# EAGLE design chalupa (EAGLE 7.7.0)
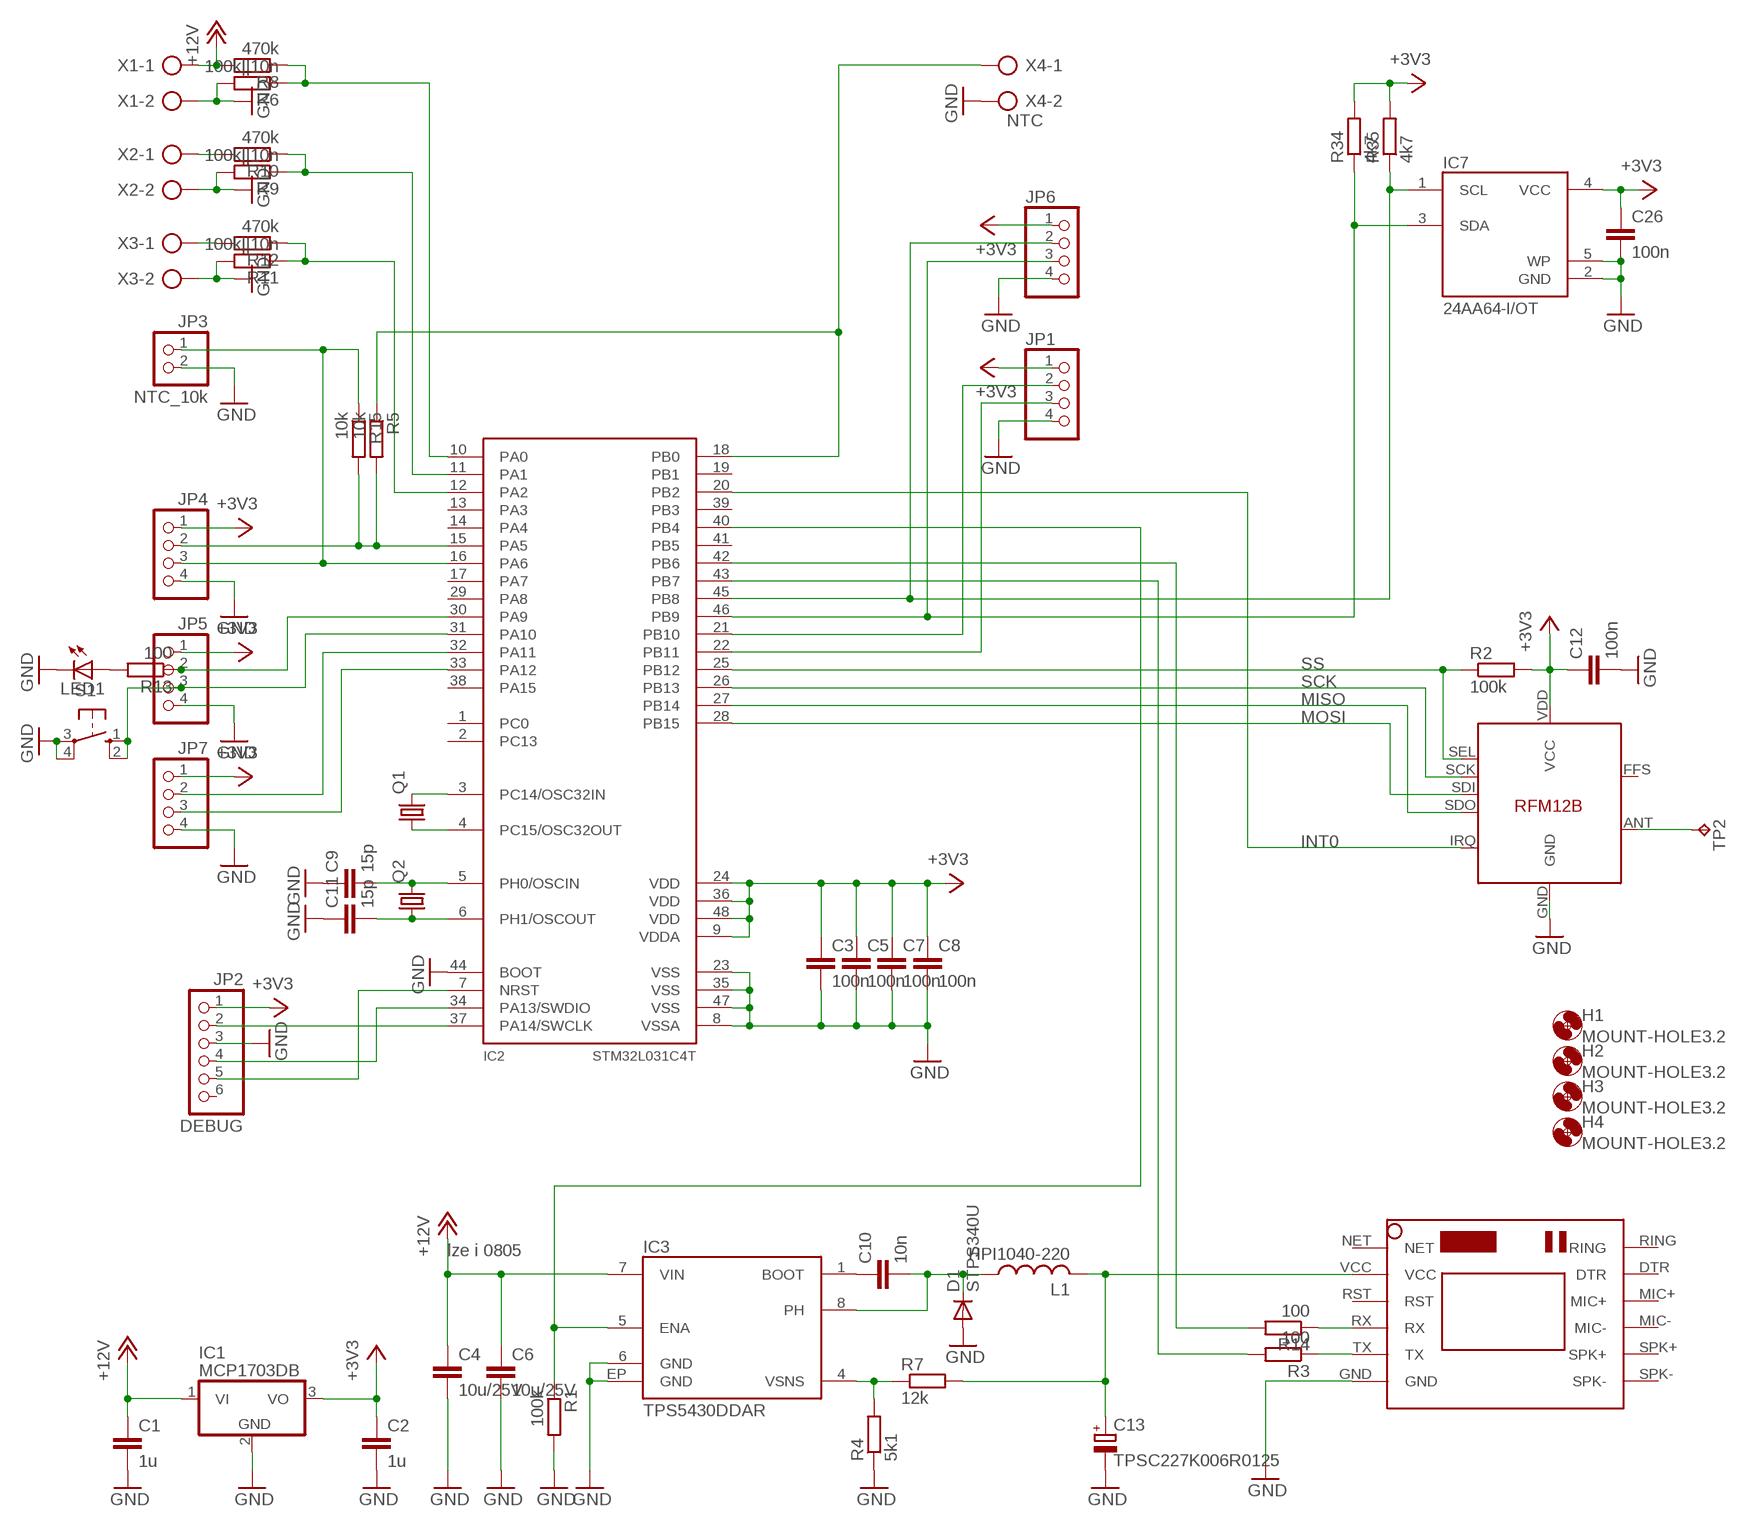
[diagram p0: schematic, sheet 1]

## Parts
C1  1u  C-EUC0603  [C0603]
C2  1u  C-EUC0603  [C0603]
C3  100n  C-EUC0603  [C0603]
C4  10u/25V  C-EUC1206  [C1206]
C5  100n  C-EUC0603  [C0603]
C6  10u/25V  C-EUC1206  [C1206]
C7  100n  C-EUC0603  [C0603]
C8  100n  C-EUC0603  [C0603]
C9  15p  C-EUC0603  [C0603]
C10  10n  C-EUC0603  [C0603]
C11  15p  C-EUC0603  [C0603]
C12  100n  C-EUC0603  [C0603]
C13  TPSC227K006R0125  CPOL-EUSMCC  [SMC_C]
C26  100n  C-EUC0603  [C0603]
D1  STPS340U  DIODE-SMB  [SMB]
H1  MOUNT-HOLE3.2  [3,2]
H2  MOUNT-HOLE3.2  [3,2]
H3  MOUNT-HOLE3.2  [3,2]
H4  MOUNT-HOLE3.2  [3,2]
IC1  MCP1703DB  [SOT223]
IC2  STM32L031C4T  [LQFP48]
IC3  TPS5430DDAR  TPS5430DDA  [DDA]
IC5  SIM800LMODULE  [SIM800LMODULE]
IC7  24AA64-I/OT  [SOT23-5]
JP1  PINHD-1X4  [1X04]
JP2  DEBUG  PINHD-1X6  [1X06]
JP3  NTC_10k  PINHD-1X2  [1X02]
JP4  PINHD-1X4  [1X04]
JP5  PINHD-1X4  [1X04]
JP6  PINHD-1X4  [1X04]
JP7  PINHD-1X4  [1X04]
L1  HPI1040-220  L-USHPI1040  [HPI1040]
LED1  LEDCHIP-LED0805  [CHIP-LED0805]
Q1  CRYSTALTC38H  [TC38H]
Q2  CRYSTALHC49UP  [HC49UP]
R1  100k  R-EU_R0603  [R0603]
R2  100k  R-EU_R0603  [R0603]
R3  100  R-EU_R0603  [R0603]
R4  5k1  R-EU_R0603  [R0603]
R5  10k  R-EU_R0603  [R0603]
R6  100k||10n  R-EU_R0603  [R0603]
R7  12k  R-EU_R0603  [R0603]
R8  470k  R-EU_R0603  [R0603]
R9  100k||10n  R-EU_R0603  [R0603]
R10  470k  R-EU_R0603  [R0603]
R11  100k||10n  R-EU_R0603  [R0603]
R12  470k  R-EU_R0603  [R0603]
R13  100  R-EU_R0603  [R0603]
R14  100  R-EU_R0603  [R0603]
R15  10k  R-EU_R0603  [R0603]
R34  4k7  R-EU_R0603  [R0603]
R35  4k7  R-EU_R0603  [R0603]
RFM12B  RFM12B  [RFM12B]
S1  10-XX  [B3F-10XX]
TP2  TPB2,54  [B2,54]
X1  AK500/2  [AK500/2]
X2  AK500/2  [AK500/2]
X3  AK500/2  [AK500/2]
X4  NTC  AK500/2  [AK500/2]

## Nets
+3V3 [power]: C2.1 C3.1 C5.1 C7.1 C8.1 C12.1 C26.1 IC1.3(VO) IC2.9(VDDA) IC2.24(VDD) IC2.36(VDD) IC2.48(VDD) IC7.4(VCC) JP1.1 JP2.1 JP4.1 JP5.1 JP6.1 JP7.1 R2.2 R34.2 R35.2 RFM12B.VDD(VCC)
+12V: C1.1 C4.1 C6.1 IC1.1(VI) IC3.7(VIN) R8.2 X1.1
EEP_SCL: IC2.45(PB8) IC7.1(SCL) JP6.2 R35.1
EEP_SDA: IC2.46(PB9) IC7.3(SDA) JP6.3 R34.1
GND: C1.2 C2.2 C3.2 C4.2 C5.2 C6.2 C7.2 C8.2 C9.1 C11.1 C12.2 C13.- C26.2 D1.A IC1.2(GND) IC2.8(VSSA) IC2.23(VSS) IC2.35(VSS) IC2.44(BOOT) IC2.47(VSS) IC3.6(GND) IC3.EP(GND) IC5.GND IC7.2(GND) IC7.5(WP) JP1.4 JP2.3 JP3.2 JP4.4 JP5.4 JP6.4 JP7.4 LED1.C R1.2 R4.1 R6.2 R9.2 R11.2 RFM12B.GND S1.3(P) S1.4(P1) X1.2 X2.2 X3.2 X4.2
GSM_EN: IC2.40(PB4) IC3.5(ENA) R1.1
INT0: IC2.20(PB2) RFM12B.IRQ
MISO: IC2.27(PB14) RFM12B.SDO
MOSI: IC2.28(PB15) RFM12B.SDI
N$1: C11.2 IC2.6(PH1/OSCOUT) Q2.1
N$2: IC5.TX R3.1
N$3: C9.2 IC2.5(PH0/OSCIN) Q2.2
N$4: IC2.4(PC15/OSC32OUT) Q1.1
N$5: IC2.3(PC14/OSC32IN) Q1.2
N$6: RFM12B.ANT TP2.PP(TP)
N$7: IC2.42(PB6) R14.2
N$8: C10.1 IC3.1(BOOT)
N$9: C13.+ IC5.VCC L1.2 R7.2
N$10: C10.2 D1.C IC3.8(PH) L1.1
N$11: IC2.21(PB10) JP1.2
N$12: IC2.22(PB11) JP1.3
N$13: IC5.RX R14.1
N$14: LED1.A R13.2
N$15: IC2.31(PA10) JP5.3 S1.1(S) S1.2(S1)
N$16: IC2.18(PB0) R5.1 X4.1
N$17: R12.2 X3.1
N$18: R10.2 X2.1
N$20: IC2.10(PA0) R6.1 R8.1
N$21: IC2.11(PA1) R9.1 R10.1
N$22: IC2.12(PA2) R11.1 R12.1
N$25: IC3.4(VSNS) R4.2 R7.1
N$27: IC2.15(PA5) JP4.2 R5.2 R15.2
N$28: IC2.16(PA6) JP3.1 JP4.3 R15.1
N$29: IC2.30(PA9) JP5.2 R13.1
N$31: IC2.32(PA11) JP7.2
N$32: IC2.33(PA12) JP7.3
N$137: IC2.34(PA13/SWDIO) JP2.4
N$138: IC2.37(PA14/SWCLK) JP2.2
N$143: IC2.7(NRST) JP2.5
SCK: IC2.26(PB13) RFM12B.SCK
SS: IC2.25(PB12) R2.1 RFM12B.SEL
TX1: IC2.43(PB7) R3.2
Unconnected: IC2.1(PC0) IC2.2(PC13) IC2.13(PA3) IC2.14(PA4) IC2.17(PA7) IC2.19(PB1) IC2.29(PA8) IC2.38(PA15) IC2.39(PB3) IC2.41(PB5) IC5.DTR IC5.MIC+ IC5.MIC- IC5.NET IC5.RING IC5.RST IC5.SPK+ IC5.SPK- JP2.6 RFM12B.FFS

## Notes on the sheet
- lze i 0805

## Library data of the parts
C1-C12 C26 = rcl:C-EU: CAPACITOR, European symbol
C13 = rcl:CPOL-EU: POLARIZED CAPACITOR, European symbol
D1 = diode:DIODE-: DIODE
H1-H4 = holes:MOUNT-HOLE: MOUNTING HOLE with drill center marker
IC1 = linear:MCP1703: 250 mA, 16V, Low Quiescent Current LDO Regulator Source: http://ww1.microchip.com/downloads/en/DeviceDoc/22049b.pdf
IC2 = alpov2:STM32L031C4T
IC3 = hvac:TPS5430
IC5 = SIM800LMODULE:SIM800LMODULE: SIM800L Module
IC7 = satcam:24AA64
JP1 JP4-JP7 = pinhead:PINHD-1X4: PIN HEADER
JP2 = pinhead:PINHD-1X6: PIN HEADER
JP3 = pinhead:PINHD-1X2: PIN HEADER
L1 = loraobd:L-US
LED1 = led:LED: LED OSRAM: - CHIPLED LG R971, LG N971, LY N971, LG Q971, LY Q971, LO R971, LY R971 LH N974, LH R974 LS Q976, LO Q976, LY Q976 LO Q996 - Hyper CHIPLED LW Q18S LB Q993, LB Q99A, LB R99A - SideLED LS A670, LO A670, LY A670, LG A670, LP A670 LB A673, LV A673, LT A673, LW A673 LH A674 LY A675 LS A676, LA A676, LO A676, LY A676, LW A676 LS A679, LY A679, LG A679 - Hyper Micro SIDELED® LS Y876, LA Y876, LO Y876, LY Y876 LT Y87S - SmartLED LW L88C, LW L88S LB L89C, LB L89S, LG L890 LS L89K, LO L89K, LY L89K LS L896, LA L896, LO L896, LY L896 - TOPLED LS T670, LO T670, LY T670, LG T670, LP T670 LSG T670, LSP T670, LSY T670, LOP T670, LYG T670 LG T671, LOG T671, LSG T671 LB T673, LV T673, LT T673, LW T673 LH T674 LS T676, LA T676, LO T676, LY T676, LB T676, LH T676, LSB T676, LW T676 LB T67C, LV T67C, LT T67C, LS T67K, LO T67K, LY T67K, LW E67C LS E67B, LA E67B, LO E67B, LY E67B, LB E67C, LV E67C, LT E67C LW T67C LS T679, LY T679, LG T679 LS T770, LO T770, LY T770, LG T770, LP T770 LB T773, LV T773, LT T773, LW T773 LH T774 LS E675, LA E675, LY E675, LS T675 LS T776, LA T776, LO T776, LY T776, LB T776 LHGB T686 LT T68C, LB T68C - Hyper Mini TOPLED® LB M676 - Mini TOPLED Santana® LG M470 LS M47K, LO M47K, LY M47K Source: http://www.osram.convergy.de LUXEON: - LUMILED® LXK2-PW12-R00, LXK2-PW12-S00, LXK2-PW14-U00, LXK2-PW14-V00 LXK2-PM12-R00, LXK2-PM12-S00, LXK2-PM14-U00 LXK2-PE12-Q00, LXK2-PE12-R00, LXK2-PE12-S00, LXK2-PE14-T00, LXK2-PE14-U00 LXK2-PB12-K00, LXK2-PB12-L00, LXK2-PB12-M00, LXK2-PB14-N00, LXK2-PB14-P00, LXK2-PB14-Q00 LXK2-PR12-L00, LXK2-PR12-M00, LXK2-PR14-Q00, LXK2-PR14-R00 LXK2-PD12-Q00, LXK2-PD12-R00, LXK2-PD12-S00 LXK2-PH12-R00, LXK2-PH12-S00 LXK2-PL12-P00, LXK2-PL12-Q00, LXK2-PL12-R00 Source: www.luxeon.com KINGBRIGHT: KA-3528ASYC Source: www.kingbright.com
Q1 Q2 = crystal:CRYSTAL: CRYSTAL; OC_FARNELL: unknown; OC_NEWARK: unknown
R1-R15 R34 R35 = rcl:R-EU_: RESISTOR, European symbol
RFM12B = JeeLabs:RFM12B
S1 = switch-omron:10-XX: OMRON SWITCH; MPN: B3F-1000; OC_FARNELL: 176432; OC_NEWARK: 36M3542
TP2 = testpad:TP: Test pad
X1-X4 = con-ptr500:AK500/2: CONNECTOR; OC_FARNELL: unknown; OC_NEWARK: unknown

## Net classes
1 power: width 0.2 mm

## Board
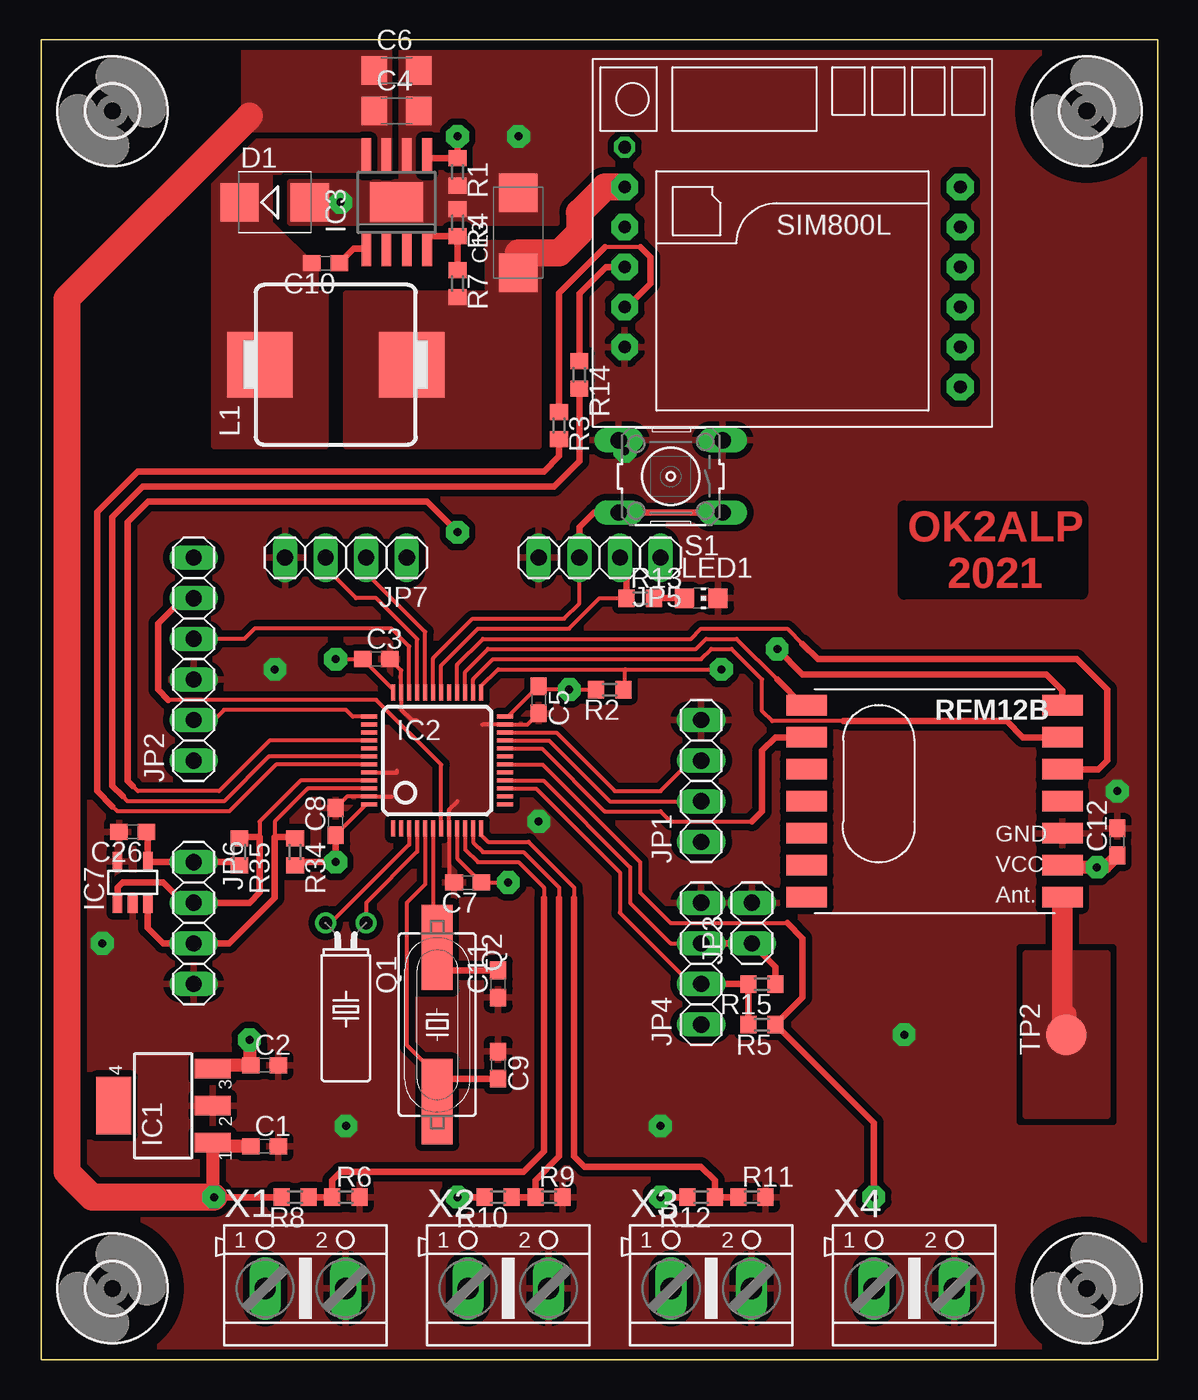
[diagram p1: board, top side]
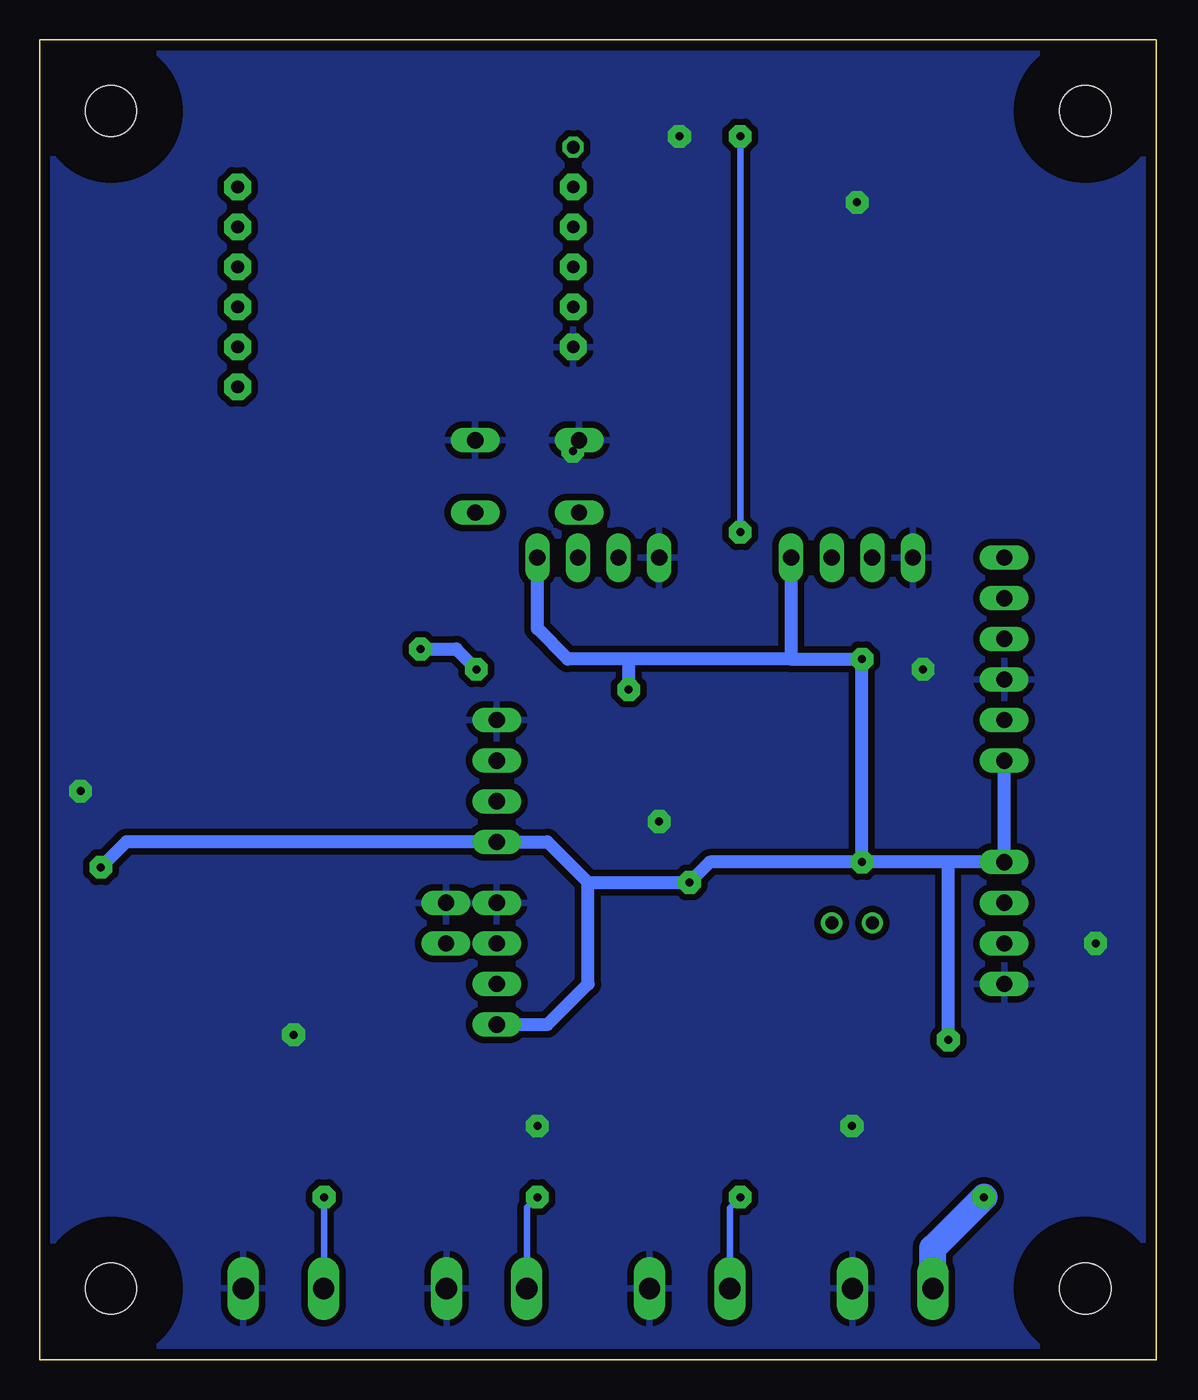
[diagram p2: board, bottom side, seen from below]

Size 69.85 x 82.55 mm. Coordinates in mm from the lower left corner, seen from the top.
Outline: 0,0 69.85,0 69.85,82.55 0,82.55 0,0
Copper layers (1*16): Top 0.035mm / dielectric 1.5mm / Bottom 0.035mm
Design rules "default *": minimum track width 0.25mm, minimum drill 0.5mm, track to track 8mil, track to pad 8mil, pad to pad 8mil, via to via 8mil, smd to smd 0mil, copper to edge 24mil, drill to drill 8mil, minimum pad ring 10mil, minimum via ring 8mil, stop-mask expansion 4mil, vias tented up to drill 0mil, thermal gap 16mil
tRestrict: 4 lines

### Footprints (pad centres in the part's own frame; a part is rotated, then mirrored left to right if it is on the bottom)
C0603 = smd 1.1 x 1: 1 -0.85,0; 2 0.85,0
C1206 = smd 1.6 x 1.8: 1 -1.4,0; 2 1.4,0
SMC_C = smd 2.4 x 2.4: + -2.5,0; - 2.5,0
SMB = smd 2.4 x 2.4: A 2.2,0; C -2.2,0
3,2 = hole 3.2: 0,0
SOT223 = smd 1.219 x 2.235: 1 -2.311,-3.099; 2 0,-3.099; 3 2.311,-3.099 | smd 3.6 x 2.2: 4 0,3.099
LQFP48 = smd 0.25 x 1: 1 -2.75,-4.25; 2 -2.25,-4.25; 3 -1.75,-4.25; 4 -1.25,-4.25; 5 -0.75,-4.25; 6 -0.25,-4.25; 7 0.25,-4.25; 8 0.75,-4.25; 9 1.25,-4.25; 10 1.75,-4.25; 11 2.25,-4.25; 12 2.75,-4.25; 25 2.75,4.25; 26 2.25,4.25; 27 1.75,4.25; 28 1.25,4.25; 29 0.75,4.25; 30 0.25,4.25; 31 -0.25,4.25; 32 -0.75,4.25; 33 -1.25,4.25; 34 -1.75,4.25; 35 -2.25,4.25; 36 -2.75,4.25 | smd 1 x 0.25: 13 4.25,-2.75; 14 4.25,-2.25; 15 4.25,-1.75; 16 4.25,-1.25; 17 4.25,-0.75; 18 4.25,-0.25; 19 4.25,0.25; 20 4.25,0.75; 21 4.25,1.25; 22 4.25,1.75; 23 4.25,2.25; 24 4.25,2.75; 37 -4.25,2.75; 38 -4.25,2.25; 39 -4.25,1.75; 40 -4.25,1.25; 41 -4.25,0.75; 42 -4.25,0.25; 43 -4.25,-0.25; 44 -4.25,-0.75; 45 -4.25,-1.25; 46 -4.25,-1.75; 47 -4.25,-2.25; 48 -4.25,-2.75
DDA = smd 0.6 x 2.2: 1 -1.905,-2.9; 2 -0.635,-2.9; 3 0.635,-2.9; 4 1.905,-2.9; 5 1.905,2.9; 6 0.635,2.9; 7 -0.635,2.9; 8 -1.905,2.9 | smd 3.3 x 2.5: EP 0,0
SIM800LMODULE = drill 0.8 pad 1.676 octagon: DTR 10.5,1; GND -10.5,-6.5; MIC+ 10.5,-1.5; MIC- 10.5,-4; RING 10.5,3.5; RST -10.5,1; RX -10.5,-1.5; SPK+ 10.5,-6.5; SPK- 10.5,-9; TX -10.5,-4; VCC -10.5,3.5 | drill 0.8 octagon: NET -10.5,6
SOT23-5 = smd 0.6 x 1.2: 1 -0.95,-1.306; 2 0,-1.306; 3 0.95,-1.306; 4 0.95,1.306; 5 -0.95,1.306
1X04 = drill 1.016 long: 1 -3.81,0; 2 -1.27,0; 3 1.27,0; 4 3.81,0
1X06 = drill 1.016 long: 1 -6.35,0; 2 -3.81,0; 3 -1.27,0; 4 1.27,0; 5 3.81,0; 6 6.35,0
1X02 = drill 1.016 long: 1 -1.27,0; 2 1.27,0
HPI1040 = smd 4.1 x 4.1: 1 0,4.75; 2 0,-4.75
CHIP-LED0805 = smd 1.2 x 1.2: A 0,-1.05; C 0,1.05
TC38H = drill 0.813: 1 -1.27,0; 2 1.27,0
HC49UP = smd 5.334 x 1.93: 1 -4.826,0; 2 4.826,0
R0603 = smd 1 x 1.1: 1 -0.85,0; 2 0.85,0
RFM12B = smd 2.54 x 1.27: ANT 8,-6; FFS -8,2; GND 8,-2; IRQ -8,4; P$8 -8,0; P$9 -8,-2; P$10 -8,-4; P$12 -8,-6; P$16 8,0; SCK 8,4; SDI 8,2; SDO -8,6; SEL 8,6; VDD 8,-4
B3F-10XX = drill 1.016 long: 1 -3.251,2.261; 2 3.251,2.261; 3 -3.251,-2.261; 4 3.251,-2.261
B2,54 = smd 2.54 x 2.54: PP 0,0
AK500/2 = drill 1.321 long: 1 -2.515,0; 2 2.515,0

### Placement (x,y rotation side)
C1  13.97,13.34 0 top
C2  13.97,18.41 0 top
C3  20.95,43.81 0 top
C4  22.23,78.11 0 top
C5  31.11,41.27 270 top
C6  22.23,80.64 0 top
C7  26.67,29.84 180 top
C8  18.41,33.66 90 top
C9  28.57,18.41 270 top
C10  17.78,68.58 180 top
C11  28.57,23.5 90 top
C12  67.31,32.38 90 top
C13  29.84,70.48 90 top
C26  5.71,33.02 180 top
D1  14.61,72.39 0 top
H1  4.45,4.45 0 top
H2  65.41,4.45 0 top
H3  4.45,78.11 0 top
H4  65.41,78.11 0 top
IC1  7.62,15.88 90 top
IC2  24.77,37.47 0 top
IC3  22.23,72.39 0 top
IC5  46.99,69.85 0 top
IC7  5.71,29.84 0 top
JP1  41.27,36.2 90 top
JP2  9.53,43.81 90 top
JP3  44.45,27.3 90 top
JP4  41.27,24.77 90 top
JP5  34.92,50.16 180 top
JP6  9.53,27.3 270 top
JP7  19.05,50.16 180 top
L1  18.41,62.23 90 top
LED1  41.27,47.62 270 top
Q1  19.05,27.3 180 top
Q2  24.77,20.95 270 top
R1  26.04,74.3 270 top
R2  35.56,41.91 180 top
R3  32.38,58.42 270 top
R4  26.04,71.12 270 top
R5  45.09,20.95 180 top
R6  19.05,10.16 0 top
R7  26.04,67.31 270 top
R8  15.88,10.16 180 top
R9  31.75,10.16 0 top
R10  28.57,10.16 180 top
R11  44.45,10.16 0 top
R12  41.27,10.16 180 top
R13  37.47,47.62 0 top
R14  33.66,61.59 270 top
R15  45.09,23.5 180 top
R34  15.88,31.75 270 top
R35  12.38,31.75 270 top
RFM12B  55.88,34.92 0 top
S1  39.37,55.24 180 top
TP2  64.14,20.32 90 top
X1  16.51,4.45 0 top
X2  29.21,4.45 0 top
X3  41.91,4.45 0 top
X4  54.61,4.45 0 top

### Tracks (layer width: path | path; a pad name or v marks a point on that pad's centre or on a via)
+3V3  (via drill 0.5 pad 1.42)
  Top 0.254: IC2.36 22.02,41.91 C3.1 v18.41,43.81 | IC2.24 29.2,40.22 C5.1 31.33,41.91 v33.02,41.91 R2.2 | IC2.48 20.32,34.72 C8.1 | IC2.9 26.02,31.35 C7.1 v29.21,29.84 | R34.2 15.88,31.11
  Top 0.406: C8.1 v18.41,31.11 15.88,31.11 | C26.1 6.67,32.92 IC7.4 6.7,31.11 JP6.1 12.38,31.11 R35.2 12.17,30.9
  Top 0.813: RFM12B.VDD 64.01,30.8 v66.04,30.8 66.57,30.8 C12.1 | IC1.3 10.95,18.41 C2.1 13.02,18.52 v13.02,20
  Bottom 0.813: v18.41,31.11 27.94,31.11 v29.21,29.84 35.56,29.84 | v18.41,31.11 v18.41,43.81 22.86,43.81 | JP7.1 22.86,43.81 | 22.86,43.81 33.02,43.81 | 33.02,43.81 36.83,43.81 38.73,45.72 JP5.1 | 33.02,43.81 v33.02,41.91 | 13.02,31.11 JP6.1 JP2.1 | 13.02,31.11 v18.41,31.11 | 35.56,29.84 38.1,32.38 JP1.1 64.45,32.38 v66.04,30.8 | JP4.1 38.1,20.95 35.56,23.5 35.56,29.84 | v13.02,20 13.02,31.11
+12V  (via drill 0.5 pad 1.42)
  Top 0.406: v10.79,10.16 R8.2
  Top 0.813: C1.1 10.95,13.34 IC1.1 10.72,10.67 10.79,10.59 v10.79,10.16
  Top 1.676: 13.02,77.79 1.59,66.36 1.59,11.75 3.17,10.16 v10.79,10.16
  Bottom 1.676: X1.1 13.99,6.96 v10.79,10.16
  pour Top (isolate 0.406, rank 3, no thermals): 12.7,76.83 12.7,81.92 22.23,81.92 22.23,74.3 20.95,74.3 20.95,76.83
EEP_SCL
  Top 0.254: IC2.45 16.21,36.22 13.65,33.66 13.65,32.7 | R35.1 12.38,32.7
  Top 0.406: IC7.1 4.76,29.53 5.08,29.84 7.62,29.84 8.89,28.57 JP6.2 13.02,28.57 13.65,29.21 13.65,32.7 12.38,32.7
EEP_SDA
  Top 0.254: IC2.46 16.66,35.72 14.61,33.66 14.61,32.7 | R34.1 15.88,32.7
  Top 0.406: IC7.3 6.67,26.99 7.62,26.04 JP6.3 11.75,26.04 14.61,28.89 14.61,32.7 15.88,32.7
GND  (via drill 0.5 pad 1.42)
  Top 0.254: C3.2 22.52,43.1 IC2.35 22.52,40.67 23.18,40.01 23.5,40.01 | C5.2 30.41,39.72 IC2.23 27.59,39.72 | C8.2 19.12,35.22 IC2.47 21.93,35.22 | C7.2 25.52,30.15 IC2.8 25.52,34.41 26.04,34.92 | IC2.44 22.23,36.72 22.23,36.83
  other vias: 14.61,43.18 19.05,14.61 67.31,35.56 38.73,14.61 31.11,33.66 29.84,76.52 18.73,72.39 36.51,56.83 3.81,26.04 53.98,20.32
  pour Top (isolate 0.406, rank 6): 0,0 69.85,0 69.85,82.55 32.38,82.55 32.38,55.88 0,55.88
  pour Top (isolate 0.406, no thermals): 15.56,71.12 15.56,73.66 22.54,73.66 22.54,81.92 32.38,81.92 32.38,71.12
  pour Bottom (isolate 0.406, rank 6): 0,0 69.85,0 69.85,82.55 0,82.55
GSM_EN  (via drill 0.5 pad 1.42)
  Top 0.254: IC2.40 14.27,38.72 11.11,35.56 6.03,35.56 5.71,35.88
  Top 0.406: IC3.5 24.27,75.14 R1.1 v26.04,76.52 | 5.71,35.88 5.4,36.2 5.4,52.39 6.67,53.66 24.13,53.66 v26.04,51.75
  Bottom 0.406: v26.04,76.52 v26.04,51.75
INT0
  Top 0.254: IC2.20 31.32,38.22 35.24,34.29 38.73,34.29 39.37,33.66 44.45,33.66
  Top 0.406: RFM12B.IRQ 45.91,38.92 45.09,38.1 45.09,34.29 44.45,33.66
MISO
  Top 0.254: IC2.27 26.52,43.02 27.94,44.45 40.96,44.45 41.59,45.09 43.5,45.09 46.04,42.55
  Top 0.406: 46.04,42.55 47.66,40.92 RFM12B.SDO
MOSI
  Top 0.254: IC2.28 26.02,43.48 27.62,45.09 40.64,45.09 41.27,45.72 46.67,45.72 47.62,44.77
  Top 0.406: 47.62,44.77 48.58,43.81 64.77,43.81 66.67,41.91 66.67,37.47 66.14,36.92 RFM12B.SDI
N$1
  Top 0.254: IC2.6 24.52,26.03 Q2.1 24.77,24.13 24.98,24.34
  Top 0.406: C11.2 24.98,24.34
N$2
  Top 0.254: 37.48,69.59 35.25,69.59
  Top 0.406: IC5.TX 36.64,65.85 38.1,67.31 38.1,68.97 37.48,69.59 | R3.1 32.38,66.72 35.25,69.59
N$3
  Top 0.254: IC2.5 24.02,29.73 22.86,28.57 22.86,19.68 24.77,17.78 24.77,17.14 | 24.77,17.14 Q2.2 | 25.18,17.57 24.77,17.14
  Top 0.406: C9.2 25.18,17.57
N$4
  Top 0.254: IC2.4 23.52,31.77 20.32,28.57 Q1.1
N$5
  Top 0.254: IC2.3 23.02,32.22 18.1,27.3 Q1.2
N$6
  Top 1.27: RFM12B.ANT 63.88,21.34 64.14,21.59
  pour Top (isolate 0.406, rank 2, no thermals): 66.67,15.24 66.67,25.4 61.59,25.4 61.59,15.24
N$7
  Top 0.254: IC2.42 14.22,37.72 11.43,34.92 5.4,34.92 5.08,35.24
  Top 0.406: 5.08,35.24 4.45,35.88 4.45,52.7 6.35,54.61 32.07,54.61 33.66,56.2 R14.2
N$8
  Top 0.406: IC3.1 19.54,69.49 C10.1
N$9
  Top 1.676: IC5.VCC 35.25,73.35 33.66,71.75 33.66,70.48 32.38,69.22 29.84,69.22 C13.+
  pour Top (isolate 0.406, no thermals): 19.05,57.15 19.05,66.67 27.94,66.67 27.94,69.85 31.11,69.85 31.11,57.15
N$10
  pour Top (isolate 0.406, rank 2, no thermals): 17.78,57.15 17.78,66.67 17.14,66.67 17.14,68.26 14.29,71.12 14.29,74.3 20.32,74.3 20.32,76.2 10.79,76.2 10.79,57.15
N$11
  Top 0.254: IC2.21 31.77,38.72 35.56,34.92 JP1.2
N$12
  Top 0.254: IC2.22 32.22,39.22 35.88,35.56 38.73,35.56 40.64,37.47 JP1.3
N$13
  Top 0.406: IC5.RX 35.33,68.35 33.66,66.67 R14.1
N$14
  Top 0.406: R13.2 LED1.A
N$15
  Top 0.254: IC2.31 24.52,43.88 26.99,46.35 32.7,46.35 33.66,47.31 JP5.3
  Top 0.406: S1.1 S1.2 34.57,52.98 33.66,52.07 JP5.3
N$16  (via drill 0.5 pad 1.42)
  Top 0.254: IC2.18 31.36,37.22 37.47,31.11 37.47,29.21 39.37,27.3 46.67,27.3
  Top 0.406: 46.67,27.3 47.62,26.35 47.62,22.64 R5.1 52.07,14.82 v52.07,10.16
  Bottom 0.406: X4.1 52.07,4.45 v52.07,10.16
N$17  (via drill 0.5 pad 1.42)
  Top 0.406: v38.73,10.16 R12.2
  Bottom 0.406: v38.73,10.16 39.37,9.53 39.37,4.47 X3.1
N$18  (via drill 0.5 pad 1.42)
  Top 0.406: v26.04,10.16 R10.2
  Bottom 0.406: X2.1 26.7,9.5 v26.04,10.16
N$20
  Top 0.254: IC2.10 26.52,31.91 27.3,31.11 29.84,31.11 31.43,29.53 31.43,28.89
  Top 0.406: 31.43,28.89 31.43,13.02 30.16,11.75 18.73,11.75 18.2,11.21 R6.1 R8.1
N$21
  Top 0.254: IC2.11 27.02,32.36 27.62,31.75 30.16,31.75 32.38,29.53 32.38,28.89
  Top 0.406: 32.38,28.89 32.38,12.7 30.9,11.21 R9.1 R10.1
N$22
  Top 0.254: IC2.12 27.52,32.81 27.94,32.38 30.48,32.38 33.34,29.53 33.34,28.89
  Top 0.406: 33.34,28.89 33.34,12.7 33.97,12.06 41.27,12.06 42.12,11.21 R12.1 R11.1
N$25
  Top 0.406: R7.1 R4.2 24.23,70.27 24.13,70.17 IC3.4
N$27
  Top 0.254: IC2.15 30.96,35.72 36.2,30.48 36.2,27.94 40.64,23.5 JP4.2
  Top 0.406: JP4.2 R15.2 R5.2
N$28
  Top 0.254: IC2.16 31.41,36.22 36.83,30.8 36.83,28.57 39.37,26.04 JP4.3
  Top 0.406: JP4.3 JP3.1 45.94,24.55 R15.1
N$29
  Top 0.254: IC2.30 25.02,43.43 27.3,45.72 33.02,45.72 34.92,47.62 R13.1
  Top 0.406: R13.1 36.62,49.74 JP5.2
N$31
  Top 0.254: IC2.32 24.02,45.52 20.32,49.21 JP7.2
N$32
  Top 0.254: IC2.33 23.52,45.06 20.95,47.62 19.68,47.62 17.78,49.53 JP7.3
N$137
  Top 0.254: IC2.34 23.02,44.61 21.91,45.72 20.95,45.72 13.34,45.72 12.7,45.09 JP2.4
N$138
  Top 0.254: IC2.37 19.48,40.22 19.05,40.64 11.43,40.64 10.79,40.01 JP2.2
N$143
  Top 0.254: IC2.7 25.02,37.22 20.95,41.27 7.94,41.27
  Top 0.406: 7.94,41.27 7.3,41.91 7.3,46.04 8.89,47.62 JP2.5
SCK
  Top 0.254: IC2.26 27.02,42.57 28.26,43.81 41.27,43.81 41.91,44.45 43.18,44.45 45.09,42.55 45.09,40.57 45.72,39.94 50.16,39.94
  Top 0.406: RFM12B.SCK 61.41,38.92 60.4,39.94 50.16,39.94
SS  (via drill 0.5 pad 1.42)
  Top 0.254: IC2.25 27.52,42.12 28.57,43.18 36.51,43.18 | 36.51,43.18 v42.55,43.18 | R2.1 36.51,41.91 36.51,43.18
  Top 0.406: v46.04,44.45 47.62,42.86 62.87,42.86 63.88,41.85 RFM12B.SEL
  Bottom 0.813: v46.04,44.45 43.81,44.45 v42.55,43.18
TX1
  Top 0.254: IC2.43 14.67,37.22 11.75,34.29 4.76,34.29 4.45,34.61
  Top 0.406: 4.45,34.61 3.49,35.56 3.49,53.02 6.03,55.56 31.43,55.56 32.38,56.52 R3.2

### Text on the board
Top: OK2ALP / 2021